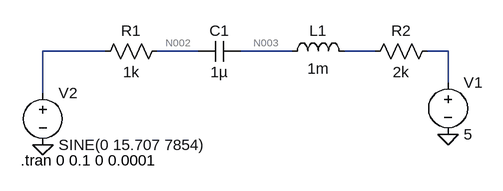
[diagram p0: schematic gate2015.asc]
gate2015.asc, the LTspice schematic file:
Version 4
SHEET 1 880 680
WIRE -48 96 -144 96
WIRE 96 96 32 96
WIRE 240 96 160 96
WIRE 368 96 320 96
WIRE 480 96 448 96
WIRE 480 144 480 96
WIRE -144 160 -144 96
FLAG -144 240 0
FLAG 480 224 0
SYMBOL res 48 80 R90
WINDOW 0 0 56 VBottom 2
WINDOW 3 32 56 VTop 2
SYMATTR InstName R1
SYMATTR Value 1k
SYMBOL res 464 80 R90
WINDOW 0 0 56 VBottom 2
WINDOW 3 32 56 VTop 2
SYMATTR InstName R2
SYMATTR Value 2k
SYMBOL ind 224 112 R270
WINDOW 0 32 56 VTop 2
WINDOW 3 5 56 VBottom 2
SYMATTR InstName L1
SYMATTR Value 1m
SYMBOL cap 96 112 R270
WINDOW 0 32 32 VTop 2
WINDOW 3 0 32 VBottom 2
SYMATTR InstName C1
SYMATTR Value 1µ
SYMBOL voltage 480 128 R0
WINDOW 123 0 0 Left 2
WINDOW 39 0 0 Left 2
SYMATTR InstName V1
SYMATTR Value 5
SYMBOL voltage -144 144 R0
WINDOW 123 0 0 Left 2
WINDOW 39 0 0 Left 2
SYMATTR InstName V2
SYMATTR Value SINE(0 15.707 7854)
TEXT -178 264 Left 2 !.tran 0 0.1 0 0.0001

The netlist it stands for:
* gate2015.asc
R1 N002 N001 1k
R2 N005 N004 2k
L1 N003 N004 1m
C1 N002 N003 1µ
V1 N005 0 5
V2 N001 0 SINE(0 15.707 7854)
.tran 0 0.1 0 0.0001
.backanno
.end

* Results of the author's LTspice run, read from the files saved beside the schematic
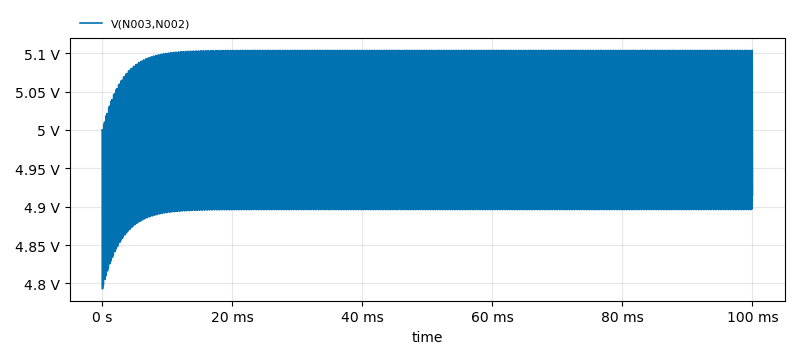
[diagram p1: Transient Analysis of gate2015.asc, plotted from the saved traces]
* Transient Analysis, 1 run:
*   V(N003,N002): min 4.793 V, max 5.104 V, average 4.997 V, rms 4.997 V, last 4.915 V